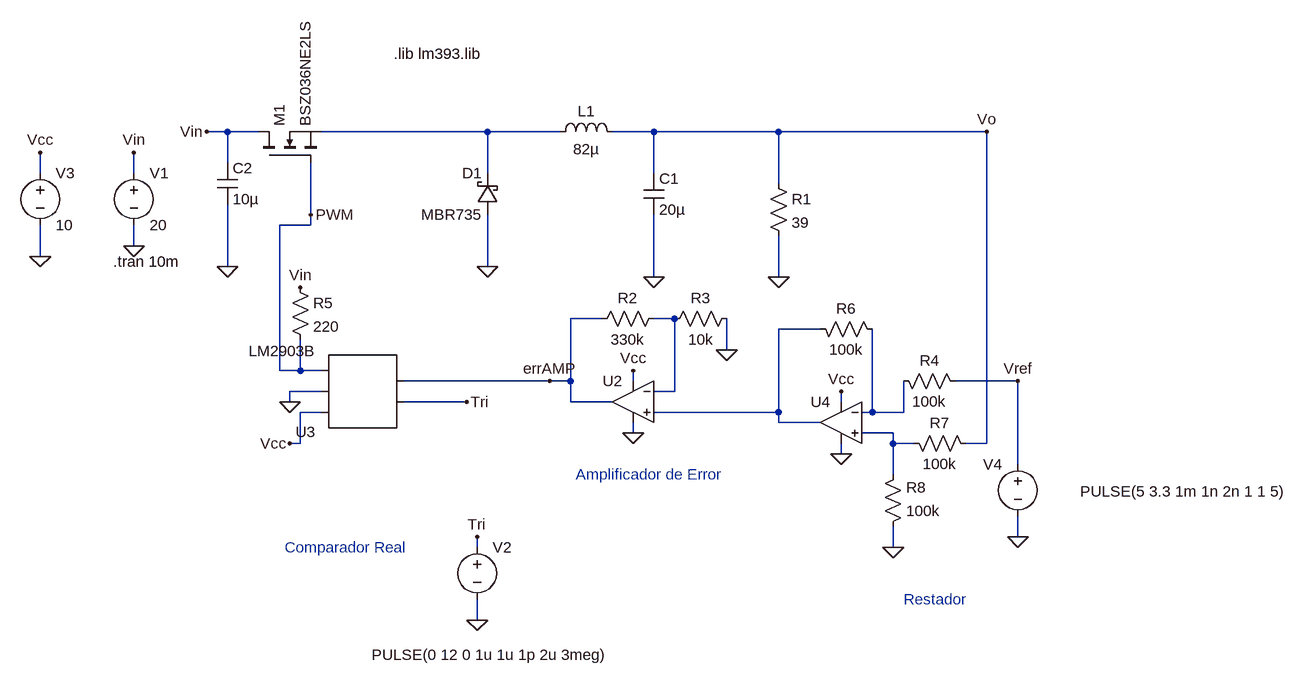
[diagram p0: schematic buck.asc]
buck.asc, the LTspice schematic file:
Version 4
SHEET 1 2164 900
WIRE 80 32 48 32
WIRE 128 32 80 32
WIRE 480 32 224 32
WIRE 592 32 480 32
WIRE 736 32 672 32
WIRE 928 32 736 32
WIRE 1248 32 928 32
WIRE 80 80 80 32
WIRE -208 96 -208 64
WIRE -64 96 -64 64
WIRE 480 96 480 32
WIRE 736 96 736 32
WIRE 928 112 928 32
WIRE 208 160 208 80
WIRE 208 176 208 160
WIRE 208 176 160 176
WIRE -64 208 -64 176
WIRE -208 224 -208 176
WIRE 80 240 80 144
WIRE 480 240 480 160
WIRE 736 256 736 160
WIRE 928 256 928 192
WIRE 656 320 608 320
WIRE 768 320 736 320
WIRE 992 336 928 336
WIRE 848 368 848 320
WIRE 160 400 160 176
WIRE 192 400 192 352
WIRE 192 400 160 400
WIRE 224 400 192 400
WIRE 576 416 352 416
WIRE 608 416 608 320
WIRE 608 416 576 416
WIRE 704 416 704 400
WIRE 1296 416 1200 416
WIRE 224 432 176 432
WIRE 768 432 768 320
WIRE 768 432 736 432
WIRE 176 448 176 432
WIRE 448 448 352 448
WIRE 608 448 608 416
WIRE 672 448 608 448
WIRE 1024 448 1024 432
WIRE 224 464 192 464
WIRE 928 464 928 336
WIRE 928 464 736 464
WIRE 1072 464 1072 336
WIRE 1072 464 1056 464
WIRE 1120 464 1120 416
WIRE 1120 464 1072 464
WIRE 928 480 928 464
WIRE 992 480 928 480
WIRE 704 496 704 480
WIRE 1104 496 1056 496
WIRE 192 512 192 464
WIRE 192 512 176 512
WIRE 1104 512 1104 496
WIRE 1136 512 1104 512
WIRE 1248 512 1248 32
WIRE 1248 512 1216 512
WIRE 1024 528 1024 512
WIRE 1296 544 1296 416
WIRE 1104 560 1104 512
WIRE 1296 656 1296 624
WIRE 464 672 464 656
WIRE 1104 672 1104 640
WIRE 464 784 464 752
FLAG -64 208 0
FLAG -64 64 Vin
FLAG 48 32 Vin
FLAG 80 240 0
FLAG 480 240 0
FLAG 736 256 0
FLAG 928 256 0
FLAG 464 784 0
FLAG -208 224 0
FLAG -208 64 Vcc
FLAG 704 400 Vcc
FLAG 704 496 0
FLAG 448 448 Tri
FLAG 576 416 errAMP
FLAG 208 160 PWM
FLAG 192 272 Vin
FLAG 176 448 0
FLAG 176 512 Vcc
FLAG 1024 432 Vcc
FLAG 1024 528 0
FLAG 1104 672 0
FLAG 1296 656 0
FLAG 1248 32 Vo
FLAG 1296 416 Vref
FLAG 848 368 0
FLAG 464 656 Tri
SYMBOL voltage -64 80 R0
WINDOW 123 0 0 Left 0
WINDOW 39 0 0 Left 0
SYMATTR InstName V1
SYMATTR Value 20
SYMBOL nmos 128 80 R270
SYMATTR InstName M1
SYMATTR Value BSZ036NE2LS
SYMBOL voltage 464 656 R0
WINDOW 3 -162 181 Left 2
WINDOW 123 0 0 Left 0
WINDOW 39 0 0 Left 0
SYMATTR Value PULSE(0 12 0 1u 1u 1p 2u 3meg)
SYMATTR InstName V2
SYMBOL schottky 496 160 R180
WINDOW 0 24 64 Left 2
WINDOW 3 24 0 Left 2
SYMATTR InstName D1
SYMATTR Value MBR735
SYMATTR Description Diode
SYMATTR Type diode
SYMBOL ind 576 48 R270
WINDOW 0 32 56 VTop 2
WINDOW 3 5 56 VBottom 2
SYMATTR InstName L1
SYMATTR Value 82µ
SYMBOL cap 720 96 R0
SYMATTR InstName C1
SYMATTR Value 20µ
SYMBOL cap 64 80 R0
SYMATTR InstName C2
SYMATTR Value 10µ
SYMBOL res 912 96 R0
SYMATTR InstName R1
SYMATTR Value 39
SYMBOL OpAmps\\UniversalOpamp2 704 448 M0
SYMATTR InstName U2
SYMBOL voltage -208 80 R0
WINDOW 123 0 0 Left 0
WINDOW 39 0 0 Left 0
SYMATTR InstName V3
SYMATTR Value 10
SYMBOL res 752 304 R90
WINDOW 0 0 56 VBottom 2
WINDOW 3 32 56 VTop 2
SYMATTR InstName R2
SYMATTR Value 330k
SYMBOL res 864 304 R90
WINDOW 0 0 56 VBottom 2
WINDOW 3 32 56 VTop 2
SYMATTR InstName R3
SYMATTR Value 10k
SYMBOL res 176 256 R0
SYMATTR InstName R5
SYMATTR Value 220
SYMBOL OpAmps\\UniversalOpamp2 1024 480 M0
SYMATTR InstName U4
SYMBOL res 1104 400 M90
WINDOW 0 0 56 VBottom 2
WINDOW 3 32 56 VTop 2
SYMATTR InstName R4
SYMATTR Value 100k
SYMBOL res 976 320 M90
WINDOW 0 0 56 VBottom 2
WINDOW 3 32 56 VTop 2
SYMATTR InstName R6
SYMATTR Value 100k
SYMBOL res 1120 496 M90
WINDOW 0 0 56 VBottom 2
WINDOW 3 32 56 VTop 2
SYMATTR InstName R7
SYMATTR Value 100k
SYMBOL res 1088 656 M180
WINDOW 0 36 76 Left 2
WINDOW 3 36 40 Left 2
SYMATTR InstName R8
SYMATTR Value 100k
SYMBOL voltage 1296 528 M0
WINDOW 123 0 0 Left 0
WINDOW 39 0 0 Left 0
WINDOW 3 -413 58 Left 2
SYMATTR Value PULSE(5 3.3 1m 1n 2n 1 1 5)
SYMATTR InstName V4
SYMBOL AutoGenerated\\LM2903B 288 432 R180
SYMATTR InstName U3
TEXT 336 -88 Left 2 !.lib lm393.lib
TEXT -96 232 Left 2 !.tran 10m
TEXT 1120 752 Left 2 ;Restador
TEXT 616 560 Left 2 ;Amplificador de Error
TEXT 168 672 Left 2 ;Comparador Real

The netlist it stands for:
* buck.asc
V1 Vin 0 20
M1 Vin PWM N001 N001 BSZ036NE2LS
V2 Tri 0 PULSE(0 12 0 1u 1u 1p 2u 3meg)
D1 0 N001 MBR735
L1 N001 Vo 82µ
C1 Vo 0 20µ
C2 Vin 0 10µ
R1 Vo 0 39
XU2 N003 N002 Vcc 0 errAMP level.2 Avol=1Meg GBW=10Meg Slew=10Meg ilimit=25m rail=0 Vos=0 phimargin=45 en=0 enk=0 in=0 ink=0 Rin=500Meg  ; pins IN+ IN- V+ V- OUT
V3 Vcc 0 10
R2 N002 errAMP 330k
R3 0 N002 10k
R5 Vin PWM 220
XU4 N005 N004 Vcc 0 N003 level.2 Avol=1Meg GBW=10Meg Slew=10Meg ilimit=25m rail=0 Vos=0 phimargin=45 en=0 enk=0 in=0 ink=0 Rin=500Meg  ; pins IN+ IN- V+ V- OUT
R4 N004 Vref 100k
R6 N003 N004 100k
R7 N005 Vo 100k
R8 0 N005 100k
V4 Vref 0 PULSE(5 3.3 1m 1n 2n 1 1 5)
* U3: LM2903B (symbol AutoGenerated\LM2903B not available, pins judged from their places): pin1=Tri pin2=errAMP pin3=Vcc pin4=0 pin5=PWM
.model D D
.lib standard.dio
.model NMOS NMOS
.model PMOS PMOS
.lib standard.mos
.lib lm393.lib
.tran 10m
* Restador
* Amplificador de Error
* Comparador Real
.lib UniversalOpamps2.sub
.backanno
.end